# Altium schematic sheet RS485.SchDoc
size A3; DocumentNumber: 3; SheetNumber: 3; SheetTotal: 5
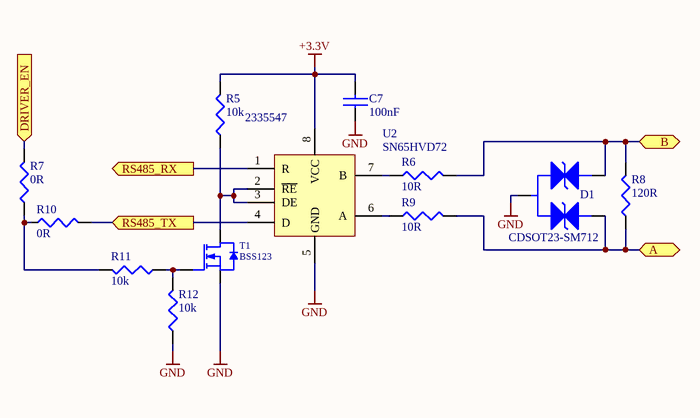
[diagram p0: RS485.SchDoc]

## Parts
C7  100nF  [CAP0603]
D1  CDSOT23-SM712  [SOT23-3AL]
R5  10k  [RES0603]
R6  10R  [RES0603]
R7  0R  [RES0603]
R8  120R  [RES0603]
R9  10R  [RES0603]
R10  0R  [RES0603]
R11  10k  [RES0603]
R12  10k  [RES0603]
T1  BSS123  [SOT23-3AL]
U2  SN65HVD72  Supplier Part Number 1: 2335547  [SOIC-8 REFLOW]

## Ports
A (bidir), B (bidir), DRIVER_EN (in), RS485_RX (out), RS485_TX (in)

## Nets
+3.3V: C7.2 R5.2 U2.8(VCC)
GND: C7.1 D1.3(ANODE) R12.1 T1.2(S) U2.5(GND)
A: D1.2(cathode) R8.1 R9.2 ; port A
B: D1.1(cathode) R6.2 R8.2 ; port B
DRIVER_EN: R7.2 ; port DRIVER_EN
RS485_RX: U2.1(R) ; port RS485_RX
RS485_TX: R10.2 U2.4(D) ; port RS485_TX
NetR5_1: R5.1 T1.3(D) U2.2(~{RE}) U2.3(DE)
NetR6_1: R6.1 U2.7(B)
NetR7_1: R7.1 R10.1 R11.2
NetR9_1: R9.1 U2.6(A)
NetR11_1: R11.1 R12.2 T1.1(G)

## Notes on the sheet
- Size: A3
- Revision:
- Sheet
- of

## Library data of the parts
C7 = C - 100nF: MURATA - GRM188R71C104KA01J - CAP, MLCC, X7R, 0.1UF, 16V, 0603; IRNAS Part No.: I-200005; Ceramic Capacitor Case: 0603 [1608 Metric]; Capacitance: 0.1; Voltage Rating: 16; Capacitance Tolerance: ± 10%; Dielectric Characteristic: X7; Product Range: GRM Series; SVHC: No SVHC (20-Jun-2016; Supplier 1: Farnell; Manufacturer: MURATA; Manufacturer Part Number: GRM188R71C104KA01J; RoHS: YES; Stock 1: 18297; Pricing 1: 10=0.0145, 100=0.0126, 500=0.0081, 2500=0.0059, 5000=0.0052, 10000=0.0046, 50000=0.0036, 100000=0.0035 (GBP); Packaging: Cut Tape; Operating Temperature Min: -55; Operating Temperature Max: 125; Automotive Qualification Standard: -; MSL: MSL 1 - Unlimited; ComponentLink1URL: http://www.farnell.com/datasheets/2189124.pdf; ComponentLink1Description: http://www.farnell.com/datasheets/2189124.pdf; Supplier Part Number 1: 2688519
D1 = D_TVS - CDSOT23-SM712: TVS Diode, CDSOT23 Series, Bidirectional, 12 V, 26 V, SOT-23, 3 Pins; Manufacturer: DIODES INC.; Manufacturer Part Number: 1N4148W-7-F.; Diode Configuration: Single; Repetitive Reverse Voltage Vrrm Max: 100; Forward Current If(AV): 300; Forward Voltage VF Max: 1.25; Reverse Recovery Time trr Max: 4; Forward Surge Current Ifsm Max: 2; Diode Case Style: SOD-123; Product Range: 1N4148 Series; SVHC: No SVHC (17-Dec-2015); Diode Type: Switching; Supplier 1: Farnell; RoHS: YES; Stock 1: 157320; Pricing 1: 1=0.136, 25=0.132, 100=0.0465, 500=0.042, 1000=0.024, 3000=0.021, 9000=0.017, 30000=0.0149 (GBP); Operating Temperature Max: 150; No. of Pins: 2; Packaging: Cut Tape; Automotive Qualification Standard: -; MSL: MSL 1 - Unlimited; Operating Temperature Min: -65; Operating Temperature Range: -65°C to +150°C<!--FANDB--><div class="features-and-benefits-container"><div class="features-and-benefits-description"><span class="features-benefits-value">The 1N4148W-7-F is a surface mount fast Switching Diode with moulded plastic case. Suitable for general purpose switching applications.</span></div><div class="features-and-benefits-list"><ul class="features-and-benefits-list-list"><li class="features-and-benefits-list-item">Fast Switching Speed</li><li class="features-and-benefits-list-item">2; ComponentLink1URL: http://www.farnell.com/datasheets/2238378.pdf; ComponentLink1Description: http://www.farnell.com/datasheets/2238378.pdf; Supplier Part Number 1: 1776392
R5 R11 R12 = R - 10k: MULTICOMP - MCMR06X103 JTL - RES, CERAMIC, 10K, 5%, 0.1W, 0603; IRNAS Part No.: I-100008; Resistance: 10; Voltage Rating: 75; Resistor Case Style: 0603 [1608 Metric]; Power Rating: 100; Product Range: MCMR Series; Temperature Coefficient: ± 100; Automotive Qualification Standard: -<!--FANDB--><div class="features-and-benefits-container"><div class="features-and-benefits-description"><span class="features-benefits-value">The Multicomp MCMR series resistors are automotive grade, anti sulphured thick film chip resistor. The resistance range includes E24 and E96 decade values from 1ohm to 10Mohm. These resistors are constructed on top of a high grade ceramic body.</span></div><div class="features-and-benefits-list"><ul class="features-and-benefits-list-list"><li class="features-and-benefits-list-item">EIA 0402, 0603, 0805, 1206 chip sizes available</li><li class="features-and-benefits-list-item">High reliability and stability</li><li class="features-and-benefits-list-item">Automotive grade AEC-Q200 compliant</li><li class="features-and-benefits-list-item">Complaint with (IEC 60068-1) 55/155/56 climatic category</li><li class="features-and-benefits-list-item">Maximum operation voltage of 50V, 75V, 150V and 200V</li><li class="features-and-benefits-list-item">Power rating of 62.5mW, 100mW, 125mW and 250mW</li><li class="features-and-benefits-list-item">Available in ±1% and ±5% tolerance</li><li class="features-and-benefits-list-item">Temperature coefficient (TCR) of +200ppm/°C, +100ppm/°C and -200ppm/°C to +400ppm/°C</li><li class="features-and-benefits-list-item">Operating temperature range -55°C to 155; Supplier 1: Farnell; Manufacturer: MULTICOMP; Manufacturer Part Number: MCMR06X103 JTL; RoHS: Y-EX; Stock 1: 19791; Pricing 1: 10=0.0087, 100=0.0074, 500=0.0061, 1000=0.0048, 2500=0.0032, 5000=0.0024, 25000=0.0016, 50000=0.0013 (GBP); Resistance Tolerance: ± 5%; Packaging: Cut Tape; Resistor Element Material: Ceramic; ComponentLink1URL: http://www.farnell.com/datasheets/1716707.pdf; ComponentLink1Description: http://www.farnell.com/datasheets/1716707.pdf; Supplier Part Number 1: 2073356
R6 R9 = R - 10R: VISHAY - RCA060310R0FKEA - RES, AUTO, THICK FILM, 10R, 1%, 0603; IRNAS Part No.: I-100010; Resistance: 10; Voltage Rating: 75; Resistor Case Style: 0603 [1608 Metric]; Power Rating: 100; Product Range: RCA Series; Temperature Coefficient: ± 100; Automotive Qualification Standard: AEC-Q200; SVHC: No SVHC (17-Dec-2015)<!--FANDB--><div class="features-and-benefits-container"><div class="features-and-benefits-description"><span class="features-benefits-value">The RCA series from Vishay are automotive grade, sulphur resistant thick film rectangular chip resistors. The resistance range includes E24 and E96 decade values from 1ohm to 10Mohm. They provide superior resistance against H2S atmosphere. These resistors have metal glaze on high quality ceramic.</span></div><div class="features-and-benefits-list"><ul class="features-and-benefits-list-list"><li class="features-and-benefits-list-item">Automotive grade AEC-Q200 qualified (rev C)</li><li class="features-and-benefits-list-item">EIA 0402, 0603, 0805, 1206, 1210, 1218, 2010 and 2512 case sizes available</li><li class="features-and-benefits-list-item">Available in ±0.5%, ±1% and ±5% tolerances</li><li class="features-and-benefits-list-item">Jumpers are also available</li><li class="features-and-benefits-list-item">±50ppm/K, ±100ppm/K and ±200ppm/K TCR values</li><li class="features-and-benefits-list-item">Power rating of 0.063W, 0.10W, 0.125W, 0.25W, 0.5W, 0.75W and 1W at 70?C</li><li class="features-and-benefits-list-item">Available in 50V, 75V, 150V, 200V, 400V and 500V limiting voltage options</li><li class="features-and-benefits-list-item">Category temperature range from -55?C to 155?C</li><li class="features-and-benefits-list-item">Stability ?R/R = 1 % for 1000h at 70; Supplier 1: Farnell; Manufacturer: VISHAY; Manufacturer Part Number: RCA060310R0FKEA; RoHS: YES; Stock 1: 9559; Pricing 1: 10=0.0803, 100=0.0386, 500=0.0235, 2500=0.015, 5000=0.0135, 10000=0.0108, 50000=0.0068, 100000=0.0067 (GBP); Resistance Tolerance: ± 1%; Packaging: Cut Tape; Resistor Element Material: Thick Film; ComponentLink1URL: http://www.farnell.com/datasheets/2111201.pdf; ComponentLink1Description: http://www.farnell.com/datasheets/2111201.pdf; Supplier Part Number 1: 2616585
R7 R10 = R - 0R: BOURNS - CR0603-J/-000ELF - RES, THICK FILM, 0R, 5%, 0.1W, 0603; IRNAS Part No.: I-100011; Resistance: 0; Voltage Rating: 50; Resistor Case Style: 0603 [1608 Metric]; Power Rating: 100; Product Range: CR Series; SVHC: No SVHC (17-Dec-2015); Resistor Mounting: Surface Mount Device<!--FANDB--><div class="features-and-benefits-container"><div class="features-and-benefits-description"><span class="features-benefits-value">The Bourns CR series are standard thick film chip resistors. These resistors provide flexibility of performance, space saving and low cost. The Resistance range includes E96 and E24 decade values from 1ohm to 10Mohm.</span></div><div class="features-and-benefits-list"><ul class="features-and-benefits-list-list"><li class="features-and-benefits-list-item">0201, 0402, 0603, 0805, 1206, 1210, 2010, 2512 standard case sizes available</li><li class="features-and-benefits-list-item">±1% and ±5% tolerance</li><li class="features-and-benefits-list-item">±100ppm/°C, ±200ppm/°C and ±250ppm/°C TCR values available</li><li class="features-and-benefits-list-item">Power rating selectable for 50mW, 63mW, 0.1W, 0.125W, 0.25W, 0.5W and 1W based on ordering</li><li class="features-and-benefits-list-item">Jumpers are available for all size</li><li class="features-and-benefits-list-item">3 layer termination process with nickel barrier prevents leaching & provides excellent solderability</li><li class="features-and-benefits-list-item">Suitable for all type of soldering processes</li><li class="features-and-benefits-list-item">Tight dimensional tolerances</li><li class="features-and-benefits-list-item">Maximum working voltage depends on case size</li><li class="features-and-benefits-list-item">Operating temperature of -55°C to +125°C(CR0201) and -55°C to +155; Supplier 1: Farnell; Manufacturer: BOURNS; Manufacturer Part Number: CR0603-J/-000ELF; RoHS: YES; Stock 1: 58200; Pricing 1: 10=0.0146, 250=0.0097, 1000=0.0073, 5000=0.0049, 12500=0.0042 (GBP); Resistance Tolerance: ± 5%; Packaging: Cut Tape; Resistor Element Material: Thick Film; Temperature Coefficient: -; Automotive Qualification Standard: -; MSL: MSL 1 - Unlimited; ComponentLink1URL: http://www.bourns.com/engineering/CHPREZTR/cr0603.stp; ComponentLink1Description: http://www.bourns.com/engineering/CHPREZTR/cr0603.stp; ComponentLink2URL: http://www.farnell.com/datasheets/2178762.pdf; ComponentLink2Description: http://www.farnell.com/datasheets/2178762.pdf; Supplier Part Number 1: 2008343
R8 = R - 120R: RES SMD 120 OHM 1% 1/4W 0603; Manufacturer: Vishay; Manufacturer Part Number: CRCW0603120RFKEAHP; Voltage Rating: 75V; Power Rating: 250mW; Temperature Coefficient: 100ppm/°C; Supplier 1: Farnell; Stock 1: 34760; Pricing 1: 10=0.141, 100=0.0937, 500=0.0669, 1000=0.0453 (EUR); Case/Package: 0603; Contact Plating: Tin; Case Code (Metric): 1608; Case Code (Imperial): 0603; Min Operating Temperature: -55°C; Max Operating Temperature: 155°C; Package Quantity: 5000; Packaging: Tape and Reel; Termination: SMD/SMT; Resistance: 120R; Tolerance: 1%; Composition: Thick Film; Number of Terminations: 2; Military Standard: Not; Max Power Dissipation: 250mW; Features: Automotive AEC-Q200; Length: 1.6mm; Height: 0.022inch; Width: 0.033inch; Depth: 0.85mm; Radiation Hardening: No; REACH SVHC: Unknown; ComponentLink1URL: https://datasheet.ciiva.com/5852/424479-5852064.pdf; ComponentLink1Description: https://datasheet.ciiva.com/5852/424479-5852064.pdf; ComponentLink2URL: https://datasheet.ciiva.com/2578/crcwhpe3-2578529.pdf; ComponentLink2Description: https://datasheet.ciiva.com/2578/crcwhpe3-2578529.pdf; ComponentLink3URL: https://datasheet.ciiva.com/8975/crcwhpe3-8975275.pdf; ComponentLink3Description: https://datasheet.ciiva.com/8975/crcwhpe3-8975275.pdf; ComponentLink4URL: https://datasheet.ciiva.com/7777/424479-7777277.pdf; ComponentLink4Description: https://datasheet.ciiva.com/7777/424479-7777277.pdf; ComponentLink5URL: https://datasheet.ciiva.com/7777/424479-7777278.pdf; ComponentLink5Description: https://datasheet.ciiva.com/7777/424479-7777278.pdf; Supplier Part Number 1: 1738892
T1 = T_M - BSS123: N-Channel Vds = 100V, Id = 170 mA; Opis / Description: MOSFET BSS123       /N-Channel; Komp / Device: SMD; Value: BSS128W; Velikost / Size: SOT23; ComponentLink1Description: Datasheet; ComponentLink1URL: C:\ELRADSVN\Altium_Library\Libraries\Active\Datasheet\BSS138BKW.pdf; Date: 11.07.2018; Supplier 1: Farnell; Supplier Part Number 1: 9845321
U2 = INT - SN65HVD72: Supplier 1: Farnell